# Altium schematic sheet Power Board1.SchDoc
size A4; SheetNumber: 1; SheetTotal: 1
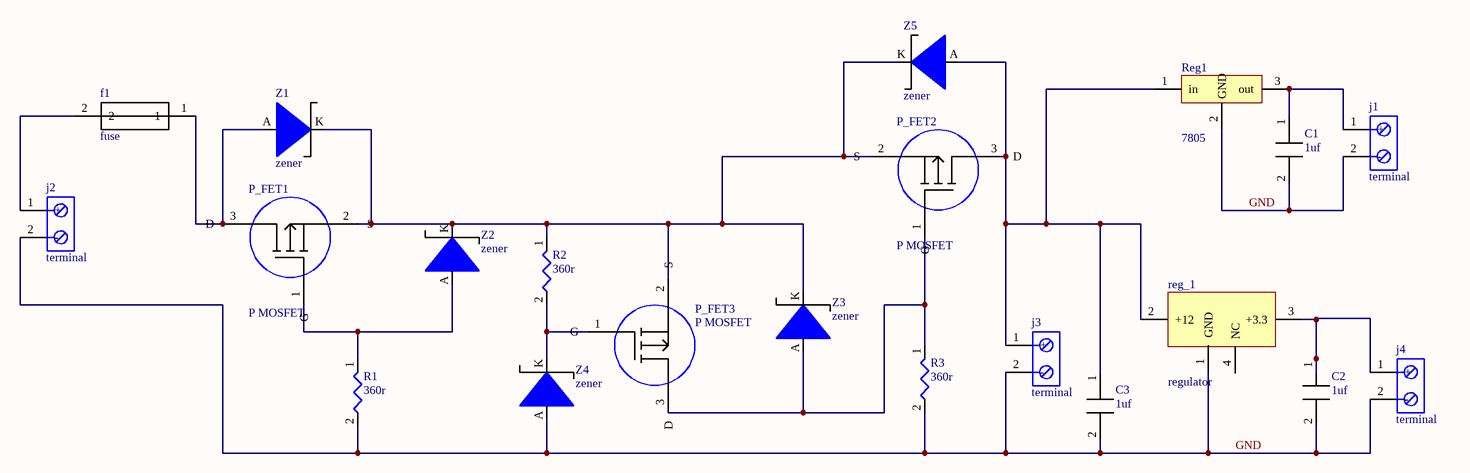
[diagram p0: Power Board1.SchDoc]

## Parts
C1  1uf  [Capacitor]
C2  1uf  [Capacitor]
C3  1uf  [Capacitor]
f1  fuse  [Fuse]
j1  terminal  [TERMINAL]
j2  terminal  [TERMINAL]
j3  terminal  [TERMINAL]
j4  terminal  [TERMINAL]
P_FET1  P MOSFET  [P-MOSFET]
P_FET2  P MOSFET  [P-MOSFET]
P_FET3  P MOSFET  [P-MOSFET]
R1  360r  [R0805]
R2  360r  [R0805]
R3  360r  [R0805]
Reg1  7805  [7805]
reg_1  regulator  [reg_3V3]
Z1  zener  [zeber]
Z2  zener  [zeber]
Z3  zener  [zeber]
Z4  zener  [zeber]
Z5  zener  [zeber]

## Nets
GND: C1.2 C2.2 C3.2 j1.2(-) j2.2(-) j3.2(-) j4.2(-) R1.2 R3.2 Reg1.2(GND) reg_1.1(GND) Z4.A
NetC1_1: C1.1 j1.1(+) Reg1.3(out)
NetC2_1: C2.1 j4.1(+) reg_1.3(+3.3)
NetC3_1: C3.1 j3.1(+) P_FET2.3(D) Reg1.1(in) reg_1.2(+12) Z5.A
Netf1_1: f1.1 P_FET1.3(D) Z1.A
Netf1_2: f1.2 j2.1(+)
NetP_FET1_1: P_FET1.1(G) R1.1 Z2.A
NetP_FET1_2: P_FET1.2(S) P_FET2.2(S) P_FET3.2(S) R2.1 Z1.K Z2.K Z3.K Z5.K
NetP_FET2_1: P_FET2.1(G) P_FET3.3(D) R3.1 Z3.A
NetP_FET3_1: P_FET3.1(G) R2.2 Z4.K

Not connected (* = marked no-connect by the designer): reg_1 4(NC)

## Library data of the parts
C1-C3 = capacitor: Aluminum Electrolytic Capacitor, Aluminum (wet); Manufacturer: Wurth Electronics; Manufacturer Part Number: 860020672005; Dielectric Material: Aluminium; Supplier: Digikey; Supplier Part Number: 732-8851-1-ND; RoHS: Yes; Category: Aluminum Electrolytic Capacitors; Stock: 10459; Pricing: 1=0.1, 50=0.089, 100=0.078, 250=0.069, 500=0.06, 1000=0.058 (USD); Pins: 2; Capacitor Type: Aluminium; Reach SVHC Compliant: Yes; RoHS Compliant: Yes; ComponentLink1URL: https://datasheet.ciiva.com:443/pdfs/VipMasterIC/IC/MIDC/MIDC-S-A0000764616/MIDC-S-A0000764162-1.pdf?src-supplier=IHS+Markit; ComponentLink1Description: https://datasheet.ciiva.com:443/pdfs/VipMasterIC/IC/MIDC/MIDC-S-A0000764616/MIDC-S-A0000764162-1.pdf?src-supplier=IHS+Markit; ComponentLink2URL: http://www.farnell.com/datasheets/1879647.pdf?src-supplier=Farnell; ComponentLink2Description: http://www.farnell.com/datasheets/1879647.pdf?src-supplier=Farnell; ComponentLink3URL: http://katalog.we-online.de/pbs/datasheet/860020672005.pdf?src-supplier=Digikey; ComponentLink3Description: http://katalog.we-online.de/pbs/datasheet/860020672005.pdf?src-supplier=Digikey; ComponentLink4URL: https://katalog.we-online.de/pbs/datasheet/860020672005.pdf?src-supplier=Digikey; ComponentLink4Description: https://katalog.we-online.de/pbs/datasheet/860020672005.pdf?src-supplier=Digikey; ComponentLink5URL: http://www.farnell.com/datasheets/1879647.pdf?src-supplier=Element14; ComponentLink5Description: http://www.farnell.com/datasheets/1879647.pdf?src-supplier=Element14
f1 = Fuse: Electric Fuse, Fast Blow, 1A, 32VAC, 63VDC, 35A (IR), Surface Mount, 0603; Manufacturer: Bel; Manufacturer Part Number: 0686F1000-01; Supplier: Digikey; Supplier Part Number: 507-2147-1-ND; RoHS: Yes; Category: Fuses; Stock: 87373; Pricing: 1=0.25, 5=0.206, 10=0.19, 50=0.1582, 100=0.1462, 250=0.13176, 500=0.12174, 1000=0.11246 (USD); ComponentLink1URL: https://belfuse.com/resources/C2F%200686F%20Apr%202017.pdf?src-supplier=Digikey; ComponentLink1Description: https://belfuse.com/resources/C2F%200686F%20Apr%202017.pdf?src-supplier=Digikey
j1-j4 = terminal: Barrier Strip Terminal Block; Manufacturer: Wurth Electronics; Manufacturer Part Number: 691137710002; Supplier: Rs; Supplier Part Number: 1769908; RoHS: No; Category: Terminal Blocks; Stock: 355; Pricing: 500=0.218, 1000=0.202, 2500=0.189 (GBP); RoHS Compliant: Yes; ComponentLink1URL: https://datasheet.ciiva.com:443/pdfs/VipMasterIC/IC/MIDC/MIDC-S-A0005074262/MIDC-S-A0004711666-1.pdf?src-supplier=IHS+Markit; ComponentLink1Description: https://datasheet.ciiva.com:443/pdfs/VipMasterIC/IC/MIDC/MIDC-S-A0005074262/MIDC-S-A0004711666-1.pdf?src-supplier=IHS+Markit; ComponentLink2URL: https://katalog.we-online.de/em/datasheet/691137710002.pdf?src-supplier=Digikey; ComponentLink2Description: https://katalog.we-online.de/em/datasheet/691137710002.pdf?src-supplier=Digikey
P_FET1-P_FET3 = P_MOSFET: Trans MOSFET P-CH 50V 0.18A Automotive AEC-Q101 3-Pin SOT-23 T/R; Manufacturer: Nexperia; Manufacturer Part Number: BSS84AK,215; Drain to Source Resistance: 4.5R; Supplier: Future Electronics; Supplier Part Number: 2027648; RoHS: Yes; Category: MOSFETs; Stock: 738000; Pricing: 3000=0.019, 9000=0.0184, 30000=0.0176, 60000=0.0173, 120000=0.0165 (USD); Pins: 3NUMBER; Packaging: 10Packaging; RoHS Compliant: Yes; ComponentLink1URL: http://www.farnell.com/datasheets/1443354.pdf?src-supplier=Farnell; ComponentLink1Description: http://www.farnell.com/datasheets/1443354.pdf?src-supplier=Farnell; ComponentLink2URL: https://assets.nexperia.com/documents/data-sheet/BSS84AK.pdf?src-supplier=Digikey; ComponentLink2Description: https://assets.nexperia.com/documents/data-sheet/BSS84AK.pdf?src-supplier=Digikey
R1-R3 = resistor: Fixed Resistor, Metal Glaze/thick Film, 0.125W, 360ohm, 150V, 1% +/-Tol, 100ppm/Cel, Surface Mount, 0805; Manufacturer: Vishay; Manufacturer Part Number: CRCW0805360RFKEA; Power: 125mW; Rated Temperature: 70°C; Temperature Coefficient: 100ppm/°C; Package Height: 0.45mm; Package Length: 2mm; Package Width: 1.25mm; Reference Standard: AEC-Q200; Supplier: Mouser; Supplier Part Number: 71-CRCW0805360RFKEA; RoHS: Yes; Category: Chip SMD Resistors; Stock: 921; Pricing: 1=0.1, 10=0.025, 50=0.025, 100=0.015, 1000=0.012, 10000=0.008 (USD); Mounting Technology: Surface Mount; Pins: 2; Package Shape: Rectangular; Case/Package: 0805; Terminal Finish: Nickel; Min Operating Temperature: -55°C; Max Operating Temperature: 155°C; Tolerance: 1%; JESD-609 Code: e3; Resistor Type: FIXED RESISTOR; Construction: Chip; Package Style: SMTMeter; Packaging: Tape and Reel; Value: 360R; Technology: METAL GLAZE/THICK FILM; Termination: Wraparound; Working Voltage: 150V; Reach SVHC Compliant: Yes; RoHS Compliant: Yes; ComponentLink1URL: https://datasheet.ciiva.com:443/pdfs/VipMasterIC/IC/VISH/VISH-S-A0007266705/VISH-S-A0007266705-1.pdf?src-supplier=IHS+Markit; ComponentLink1Description: https://datasheet.ciiva.com:443/pdfs/VipMasterIC/IC/VISH/VISH-S-A0007266705/VISH-S-A0007266705-1.pdf?src-supplier=IHS+Markit; ComponentLink2URL: https://datasheet.ciiva.com/2467/dcrcwe3-2467773.pdf?src-supplier=Digikey; ComponentLink2Description: https://datasheet.ciiva.com/2467/dcrcwe3-2467773.pdf?src-supplier=Digikey
Reg1 = 7805: Fixed Positive Standard Regulator, 5VBIPolar, PSFM3; Manufacturer: STMicroelectronics; Manufacturer Part Number: L7805C-V; Max Supply Voltage: 25V; Min Input Voltage: 7V; Channels: 1; Output Current1-Max: 1.5A; Output Voltage1-Max: 5.25V; Output Voltage1-Min: 4.75V; Output Voltage1-Nom: 5V; Regulator Type: FIXED POSITIVE SINGLE OUTPUT STANDARD REGULATOR; Surface Mount: No; Qualification Status: Not Qualified; Supplier: Future Electronics; Supplier Part Number: 4561296; RoHS: Yes; Category: Voltage Regulators - Linear; Stock: 420050; Pricing: 50=0.137, 750=0.13, 2500=0.126, 7500=0.123, 25000=0.115 (USD); Pins: 3; Package Shape: Rectangular; Terminal Finish: Tin; JESD-609 Code: e3; Operating Temperature, TJ-Max: 125°C; Operating Temperature, TJ-Min: 0°C; Package Style: FLANGE MOUNTMeter; Technology: BIPOLAR; Terminal Form: Through Hole; Terminal Position: SINGLE; RoHS Compliant: Yes; Reach SVHC Compliant: No; ComponentLink1URL: https://datasheet.ciiva.com:443/pdfs/VipMasterIC/IC/SGST/SGST-S-A0006334694/SGST-S-A0006334694-1.pdf?src-supplier=IHS+Markit; ComponentLink1Description: https://datasheet.ciiva.com:443/pdfs/VipMasterIC/IC/SGST/SGST-S-A0006334694/SGST-S-A0006334694-1.pdf?src-supplier=IHS+Markit; ComponentLink2URL: https://datasheet.ciiva.com/15111/getdatasheetpartid-44136-15111027.pdf?src-supplier=Verical; ComponentLink2Description: https://datasheet.ciiva.com/15111/getdatasheetpartid-44136-15111027.pdf?src-supplier=Verical; ComponentLink3URL: https://datasheet.ciiva.com/19480/924633-19480531.pdf?src-supplier=Jameco; ComponentLink3Description: https://datasheet.ciiva.com/19480/924633-19480531.pdf?src-supplier=Jameco; ComponentLink4URL: https://datasheet.ciiva.com/29156/156048-da-01-en-spannungsregler-l-7805-cv-to220-stm-29156924.pdf?src-supplier=Conrad; ComponentLink4Description: https://datasheet.ciiva.com/29156/156048-da-01-en-spannungsregler-l-7805-cv-to220-stm-29156924.pdf?src-supplier=Conrad; ComponentLink5URL: https://datasheet.ciiva.com/2043/cd00000444-2043986.pdf?src-supplier=Digikey; ComponentLink5Description: https://datasheet.ciiva.com/2043/cd00000444-2043986.pdf?src-supplier=Digikey; ComponentLink6URL: https://datasheet.ciiva.com/1512/1805459-1512333.pdf?src-supplier=Element14; ComponentLink6Description: https://datasheet.ciiva.com/1512/1805459-1512333.pdf?src-supplier=Element14; ComponentLink7URL: https://datasheet.ciiva.com/14149/tel78xx-l78xxc-e-14149770.pdf?src-supplier=Distrelec; ComponentLink7Description: https://datasheet.ciiva.com/14149/tel78xx-l78xxc-e-14149770.pdf?src-supplier=Distrelec; ComponentLink8URL: https://datasheet.ciiva.com/6884/1805459-6884463.pdf?src-supplier=Newark; ComponentLink8Description: https://datasheet.ciiva.com/6884/1805459-6884463.pdf?src-supplier=Newark; ComponentLink9URL: https://datasheet.ciiva.com/2073/cd00000444-2073087.pdf?src-supplier=Digikey; ComponentLink9Description: https://datasheet.ciiva.com/2073/cd00000444-2073087.pdf?src-supplier=Digikey; ComponentLink10URL: https://datasheet.ciiva.com/16458/cd00000444-16458159.pdf?src-supplier=Future+Electronics; ComponentLink10Description: https://datasheet.ciiva.com/16458/cd00000444-16458159.pdf?src-supplier=Future+Electronics; ComponentLink11URL: https://datasheet.ciiva.com/1511/1805459-1511914.pdf?src-supplier=Element14; ComponentLink11Description: https://datasheet.ciiva.com/1511/1805459-1511914.pdf?src-supplier=Element14; ComponentLink12URL: https://datasheet.ciiva.com/1511/1805459-1511915.pdf?src-supplier=Element14; ComponentLink12Description: https://datasheet.ciiva.com/1511/1805459-1511915.pdf?src-supplier=Element14
reg_1 = 12v-3.3v: Fixed Positive LDO Regulator, 3.3V, 1V Dropout, CMOS, PDSO4; Manufacturer: ON Semiconductor; Manufacturer Part Number: NCP553SQ33T1G; Package Body Material: Plastic; Dropout Voltage1-Nom: 650mV; Input Voltage Absolute-Max: 12V; Min Input Voltage: 4.3V; Line Regulation-Max: 0.0347%; Load Regulation-Max: 0.0632%; Channels: 1; Output Current1-Max: 80mA; Output Voltage1-Max: 3.399V; Output Voltage1-Min: 3.201V; Package Equivalence Code: SOT-343R; Regulator Type: FIXED POSITIVE SINGLE OUTPUT LDO REGULATOR; Time @ Peak Reflow Temperature-Max (s): 40s; Voltage Tolerance-Max: 3%; Qualification Status: Not Qualified; Supplier: Digikey; Supplier Part Number: NCP553SQ33T1GOSCT-ND; RoHS: Yes; Category: Voltage Regulators - Linear; Stock: 9110; Pricing: 1=0.63, 10=0.555, 25=0.5216, 100=0.3954, 250=0.33652, 500=0.3197, 1000=0.24399 (USD); Case/Package: TSOP; Pins: 4; Package Shape: Rectangular; Terminal Finish: Tin; Min Operating Temperature: -40°C; Max Operating Temperature: 85°C; JESD-609 Code: e3; Adjustability: FIXED; Dropout Voltage1-Max: 1V; Max Supply Voltage: 12V; JESD-30 Code: R-PDSO-G4; Moisture Sensitivity Level: 1; Number of Outputs: 1; Operating Temperature, TJ-Max: 125°C; Output Voltage1-Nom: 3.3V; Package Style: SMALL OUTLINE, THIN PROFILEMeter; Packaging: Tape and Reel; Peak Reflow Temperature (Cel): 260°C; Surface Mount: Yes; Technology: CMOS; Terminal Form: Gull Wing; Terminal Position: DUAL; Length: 2mm; Width: 1.25mm; Height - Seated (Max): 1.1mm; Terminal Pitch: 1.3mm; Reach SVHC Compliant: Yes; RoHS Compliant: Yes; ComponentLink1URL: https://datasheet.ciiva.com:443/pdfs/VipMasterIC/IC/ONSM/ONSM-S-A0003590534/ONSM-S-A0002812272-1.pdf?src-supplier=IHS+Markit; ComponentLink1Description: https://datasheet.ciiva.com:443/pdfs/VipMasterIC/IC/ONSM/ONSM-S-A0003590534/ONSM-S-A0002812272-1.pdf?src-supplier=IHS+Markit; ComponentLink2URL: https://datasheet.ciiva.com/16468/ncp552-d-16468774.pdf?src-supplier=Future+Electronics; ComponentLink2Description: https://datasheet.ciiva.com/16468/ncp552-d-16468774.pdf?src-supplier=Future+Electronics; ComponentLink3URL: https://datasheet.ciiva.com/8231/ncp553-d-8231626.pdf?src-supplier=Avnet; ComponentLink3Description: https://datasheet.ciiva.com/8231/ncp553-d-8231626.pdf?src-supplier=Avnet; ComponentLink4URL: https://datasheet.ciiva.com/6581/ncp553-d-6581414.pdf?src-supplier=Digikey; ComponentLink4Description: https://datasheet.ciiva.com/6581/ncp553-d-6581414.pdf?src-supplier=Digikey
Z1-Z5 = zener diode: Zener Diode, 12V V(Z), 5.39%, 0.37W, Silicon, Unidirectional; Manufacturer: Diodes; Manufacturer Part Number: BZT52C12-13-F; Supplier: Digikey; Supplier Part Number: BZT52C1213-FDICT-ND; RoHS: No; Category: Zener Diodes; Stock: 483720; Pricing: 1=0.15, 10=0.101, 100=0.0494, 500=0.04118, 1000=0.02861, 2000=0.02479, 5000=0.023 (USD); RoHS Compliant: No; ComponentLink1URL: https://datasheet.ciiva.com:443/pdfs/VipMasterIC/IC/DIOD/DIODS15473/DIODS15473-1.pdf?src-supplier=IHS+Markit; ComponentLink1Description: https://datasheet.ciiva.com:443/pdfs/VipMasterIC/IC/DIOD/DIODS15473/DIODS15473-1.pdf?src-supplier=IHS+Markit; ComponentLink2URL: http://www.farnell.com/datasheets/2704937.pdf?src-supplier=Farnell; ComponentLink2Description: http://www.farnell.com/datasheets/2704937.pdf?src-supplier=Farnell; ComponentLink3URL: http://components.arrow.com/part/dataview/43501861S426489N2867?src-supplier=Arrow+Electronics; ComponentLink3Description: http://components.arrow.com/part/dataview/43501861S426489N2867?src-supplier=Arrow+Electronics; ComponentLink4URL: https://www.diodes.com/assets/Datasheets/ds18004.pdf?src-supplier=Digikey; ComponentLink4Description: https://www.diodes.com/assets/Datasheets/ds18004.pdf?src-supplier=Digikey; ComponentLink5URL: http://www.diodes.com/datasheets/ds18004.pdf?src-supplier=Avnet; ComponentLink5Description: http://www.diodes.com/datasheets/ds18004.pdf?src-supplier=Avnet; ComponentLink6URL: http://www.farnell.com/datasheets/2704937.pdf?src-supplier=Newark; ComponentLink6Description: http://www.farnell.com/datasheets/2704937.pdf?src-supplier=Newark